# Altium schematic sheet digital.SchDoc
size 209 x 297 mm; Scale: 1:1; Разраб.: Наумов; Обозначение документа: АБВГ.123456.001 Э3; Пров.: Некрасов; Утв.: Некрасов; Номер листа: 3; Общее количество листов: 3; Масштаб: 1:1; Литера: У; Наименование организации: НИЯУ МИФИ; Перв. применение: АБВГ.123456.000; Наименование изделия 1: Плата цифровая; Наименование изделия 2: Схема электрическая; Наименование изделия 3: принципиальная; Нач. отд.: Нач. отд.
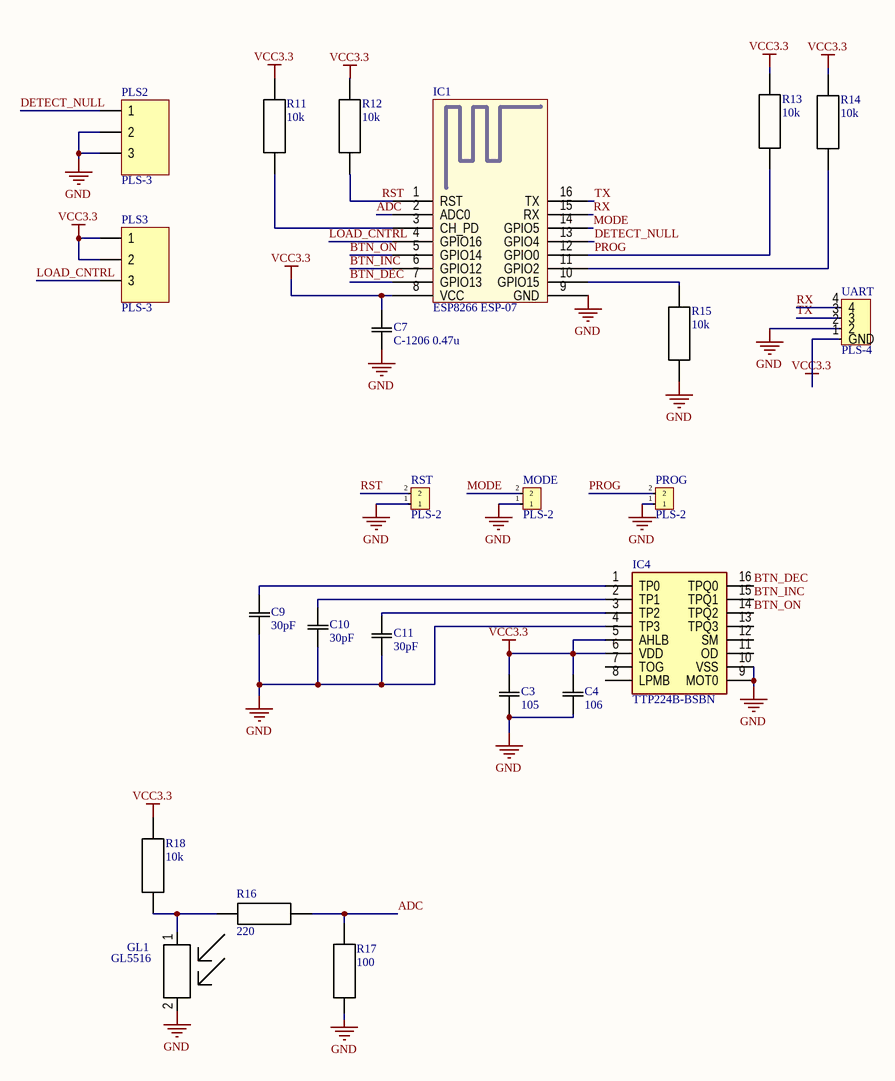
[diagram p0: digital.SchDoc]

## Parts
C3  105  [G-21_MUR]
C4  106  [G-21_MUR]
C7  C-1206 0.47u  [CAP_X7R_1206_AVX]
C9  30pF  [G-21_MUR]
C10  30pF  [G-21_MUR]
C11  30pF  [G-21_MUR]
GL1  GL5516  [GL5516]
IC1  ESP8266 ESP-07  [ESP8266 ESP-07]
IC4  TTP224B-BSBN  [SOP64P600X175-16N]
MODE  PLS-2  [PLS-2]
PLS2  PLS-3  [PLS-3]
PLS3  PLS-3  [PLS-3]
PROG  PLS-2  [PLS-2]
R11  10k  [G-21_MUR]
R12  10k  [G-21_MUR]
R13  10k  [G-21_MUR]
R14  10k  [G-21_MUR]
R15  10k  [G-21_MUR]
R16  220  [G-21_MUR]
R17  100  [G-21_MUR]
R18  10k  [G-21_MUR]
RST  PLS-2  [PLS-2]
UART  PLS-4  [PLS-4]

## Nets
GND: C3.1 C4.1 C7.1 C9.1 C10.1 C11.1 GL1.2 IC1.9(GND) IC4.4(TP3) IC4.9(MOT0) IC4.10(VSS) MODE.1 PLS2.2 PLS2.3 PROG.1 R15.1 R17.1 RST.1 UART.2
VCC3.3: C3.2 C4.2 C7.2 IC1.8(VCC) IC4.5(AHLB) IC4.6(VDD) PLS3.1 PLS3.2 R11.2 R12.2 R13.2 R14.2 R18.2 UART.1(GND)
ADC: IC1.2(ADC0) R16.1 R17.2
BTN_DEC: IC1.7(GPIO13) IC4.16(TPQ0)
BTN_INC: IC1.6(GPIO12) IC4.15(TPQ1)
BTN_ON: IC1.5(GPIO14) IC4.14(TPQ2)
DETECT_NULL: IC1.13(GPIO4) PLS2.1
LOAD_CNTRL: IC1.4(GPIO16) PLS3.3
MODE: IC1.14(GPIO5) MODE.2
PROG: IC1.12(GPIO0) PROG.2 R13.1
RST: IC1.1(RST) R12.1 RST.2
RX: IC1.15(RX) UART.4
TX: IC1.16(TX) UART.3
NetC9_2: C9.2 IC4.1(TP0)
NetC10_2: C10.2 IC4.2(TP1)
NetC11_2: C11.2 IC4.3(TP2)
NetGL1_1: GL1.1 R16.2 R18.1
NetIC1_3: IC1.3(CH_PD) R11.1
NetIC1_10: IC1.10(GPIO15) R15.2
NetIC1_11: IC1.11(GPIO2) R14.1

Not connected (* = marked no-connect by the designer): IC4 7(TOG) 8(LPMB) 11(OD) 12(SM) 13(TPQ3)

## Notes on the sheet
- Перв. примен.
- Справ. №
- Подп. и дата
- Инв. № дубл.
- Взам. инв. №
- Разраб.
- Изм.
- Лист
- № докум.
- Подп.
- Дата
- Лит.
- Масса
- Масштаб
- Пров.
- Т.контр.
- Листов
- Инв. № подл.
- Утв.
- Н.контр.
- Копировал
- Формат А4

## Library data of the parts
C3 C4 C9-C11 = cap0805: Manufacturer_Part_Number: GRM21BR71H224KA01L; Vendor: Murata; SourceLibrary: Murata_2014-12-31; Type: DEV; Copyright: Copyright (C) 2015 Accelerated Designs. All rights reserved; RefDes: RefDes
C7 = C-1206: No Description Available; Manufacturer_Part_Number: 12061C104KAT2A; Vendor: AVX Corporation; Built_By: EMA_UL_Team; SourceLibrary: AVX_2012-08-08; Type: DEV; Copyright: Copyright (C) 2018 Accelerated Designs. All rights reserved; RefDes: RefDes
IC4 = TTP224B-BSBN: Integrated Circuit; Manufacturer_Name: TONTEK; Datasheet Link: https://datasheet.lcsc.com/szlcsc/Tontek-Design-Tech-TTP224B-BSBN_C94149.pdf; Height: 1.75mm; Manufacturer_Part_Number: TTP224B-BSBN
R11-R18 = res0805: Resistor 0805